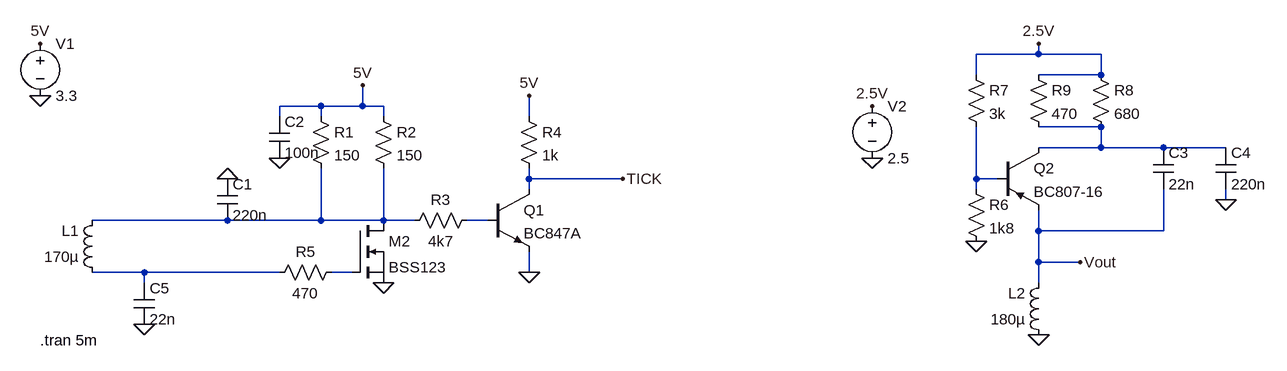
[diagram p0: schematic Draft1.asc]
Draft1.asc, the LTspice schematic file:
Version 4
SHEET 1 1704 680
WIRE 1344 -144 1344 -160
WIRE 1344 -144 1248 -144
WIRE 1440 -144 1344 -144
WIRE 1248 -112 1248 -144
WIRE 1440 -112 1440 -144
WIRE 1440 -112 1344 -112
WIRE 240 -64 176 -64
WIRE 304 -64 304 -96
WIRE 304 -64 240 -64
WIRE 336 -64 304 -64
WIRE 176 -48 176 -64
WIRE 240 -48 240 -64
WIRE 336 -48 336 -64
WIRE 560 -48 560 -80
WIRE 1440 -32 1344 -32
WIRE 1440 0 1440 -32
WIRE 1440 0 1344 0
WIRE 1536 0 1440 0
WIRE 1632 0 1536 0
WIRE 560 48 560 32
WIRE 704 48 560 48
WIRE 1248 48 1248 -32
WIRE 1280 48 1248 48
WIRE 560 64 560 48
WIRE 1248 64 1248 48
WIRE 1632 80 1632 64
WIRE 96 112 -112 112
WIRE 240 112 240 32
WIRE 240 112 96 112
WIRE 336 112 336 32
WIRE 336 112 240 112
WIRE 384 112 336 112
WIRE 496 112 464 112
WIRE 1344 128 1344 96
WIRE 1536 128 1536 64
WIRE 1536 128 1344 128
WIRE 1344 176 1344 128
WIRE 1408 176 1344 176
WIRE -32 192 -112 192
WIRE 176 192 -32 192
WIRE 288 192 256 192
WIRE 560 192 560 160
WIRE -32 208 -32 192
WIRE 1344 208 1344 176
FLAG 96 48 0
FLAG 176 16 0
FLAG 560 192 0
FLAG 560 -80 5V
FLAG 704 48 TICK
FLAG 336 208 0
FLAG -32 272 0
FLAG 304 -96 5V
FLAG -192 -80 0
FLAG -192 -160 5V
FLAG 1248 144 0
FLAG 1088 16 0
FLAG 1088 -64 2.5V
FLAG 1344 -160 2.5V
FLAG 1632 80 0
FLAG 1344 288 0
FLAG 1408 176 Vout
SYMBOL cap 80 48 R0
SYMATTR InstName C1
SYMATTR Value 220n
SYMBOL res 224 -64 R0
SYMATTR InstName R1
SYMATTR Value 150
SYMBOL res 320 -64 R0
SYMATTR InstName R2
SYMATTR Value 150
SYMBOL cap 160 -48 R0
SYMATTR InstName C2
SYMATTR Value 100n
SYMBOL res 480 96 R90
WINDOW 0 0 56 VBottom 2
WINDOW 3 32 56 VTop 2
SYMATTR InstName R3
SYMATTR Value 4k7
SYMBOL npn 496 64 R0
SYMATTR InstName Q1
SYMATTR Value BC847A
SYMBOL res 544 -64 R0
SYMATTR InstName R4
SYMATTR Value 1k
SYMBOL res 272 176 R90
WINDOW 0 0 56 VBottom 2
WINDOW 3 32 56 VTop 2
SYMATTR InstName R5
SYMATTR Value 470
SYMBOL cap -48 208 R0
SYMATTR InstName C5
SYMATTR Value 22n
SYMBOL ind -96 208 R180
WINDOW 0 36 80 Left 2
WINDOW 3 36 40 Left 2
SYMATTR InstName L1
SYMATTR Value 170µ
SYMBOL nmos 288 112 R0
SYMATTR InstName M2
SYMATTR Value BSS123
SYMBOL voltage -192 -176 R0
WINDOW 123 0 0 Left 0
WINDOW 39 0 0 Left 0
SYMATTR InstName V1
SYMATTR Value 3.3
SYMBOL pnp 1280 0 R0
SYMATTR InstName Q2
SYMATTR Value BC807-16
SYMBOL res 1232 48 R0
SYMATTR InstName R6
SYMATTR Value 1k8
SYMBOL res 1232 -128 R0
SYMATTR InstName R7
SYMATTR Value 3k
SYMBOL res 1424 -128 R0
SYMATTR InstName R8
SYMATTR Value 680
SYMBOL res 1328 -128 R0
SYMATTR InstName R9
SYMATTR Value 470
SYMBOL voltage 1088 -80 R0
WINDOW 123 0 0 Left 0
WINDOW 39 0 0 Left 0
SYMATTR InstName V2
SYMATTR Value 2.5
SYMBOL cap 1520 0 R0
SYMATTR InstName C3
SYMATTR Value 22n
SYMBOL cap 1616 0 R0
SYMATTR InstName C4
SYMATTR Value 220n
SYMBOL ind 1360 304 R180
WINDOW 0 36 80 Left 2
WINDOW 3 36 40 Left 2
SYMATTR InstName L2
SYMATTR Value 180µ
TEXT -192 296 Left 2 !.tran 5m

The netlist it stands for:
* Draft1.asc
C1 0 N003 220n
R1 5V N003 150
R2 5V N003 150
C2 5V 0 100n
R3 N004 N003 4k7
Q1 TICK N004 0 0 BC847A
R4 5V TICK 1k
R5 N006 N005 470
C5 N005 0 22n
L1 N005 N003 170µ
M2 N003 N006 0 0 BSS123
V1 5V 0 3.3
Q2 N001 N002 Vout 0 BC807-16
R6 N002 0 1k8
R7 2.5V N002 3k
R8 2.5V N001 680
R9 2.5V N001 470
V2 2.5V 0 2.5
C3 N001 Vout 22n
C4 N001 0 220n
L2 0 Vout 180µ
.model NPN NPN
.model PNP PNP
.lib standard.bjt
.model NMOS NMOS
.model PMOS PMOS
.lib standard.mos
.tran 5m
.backanno
.end